# EAGLE design Current ACS712 (EAGLE 6.2)
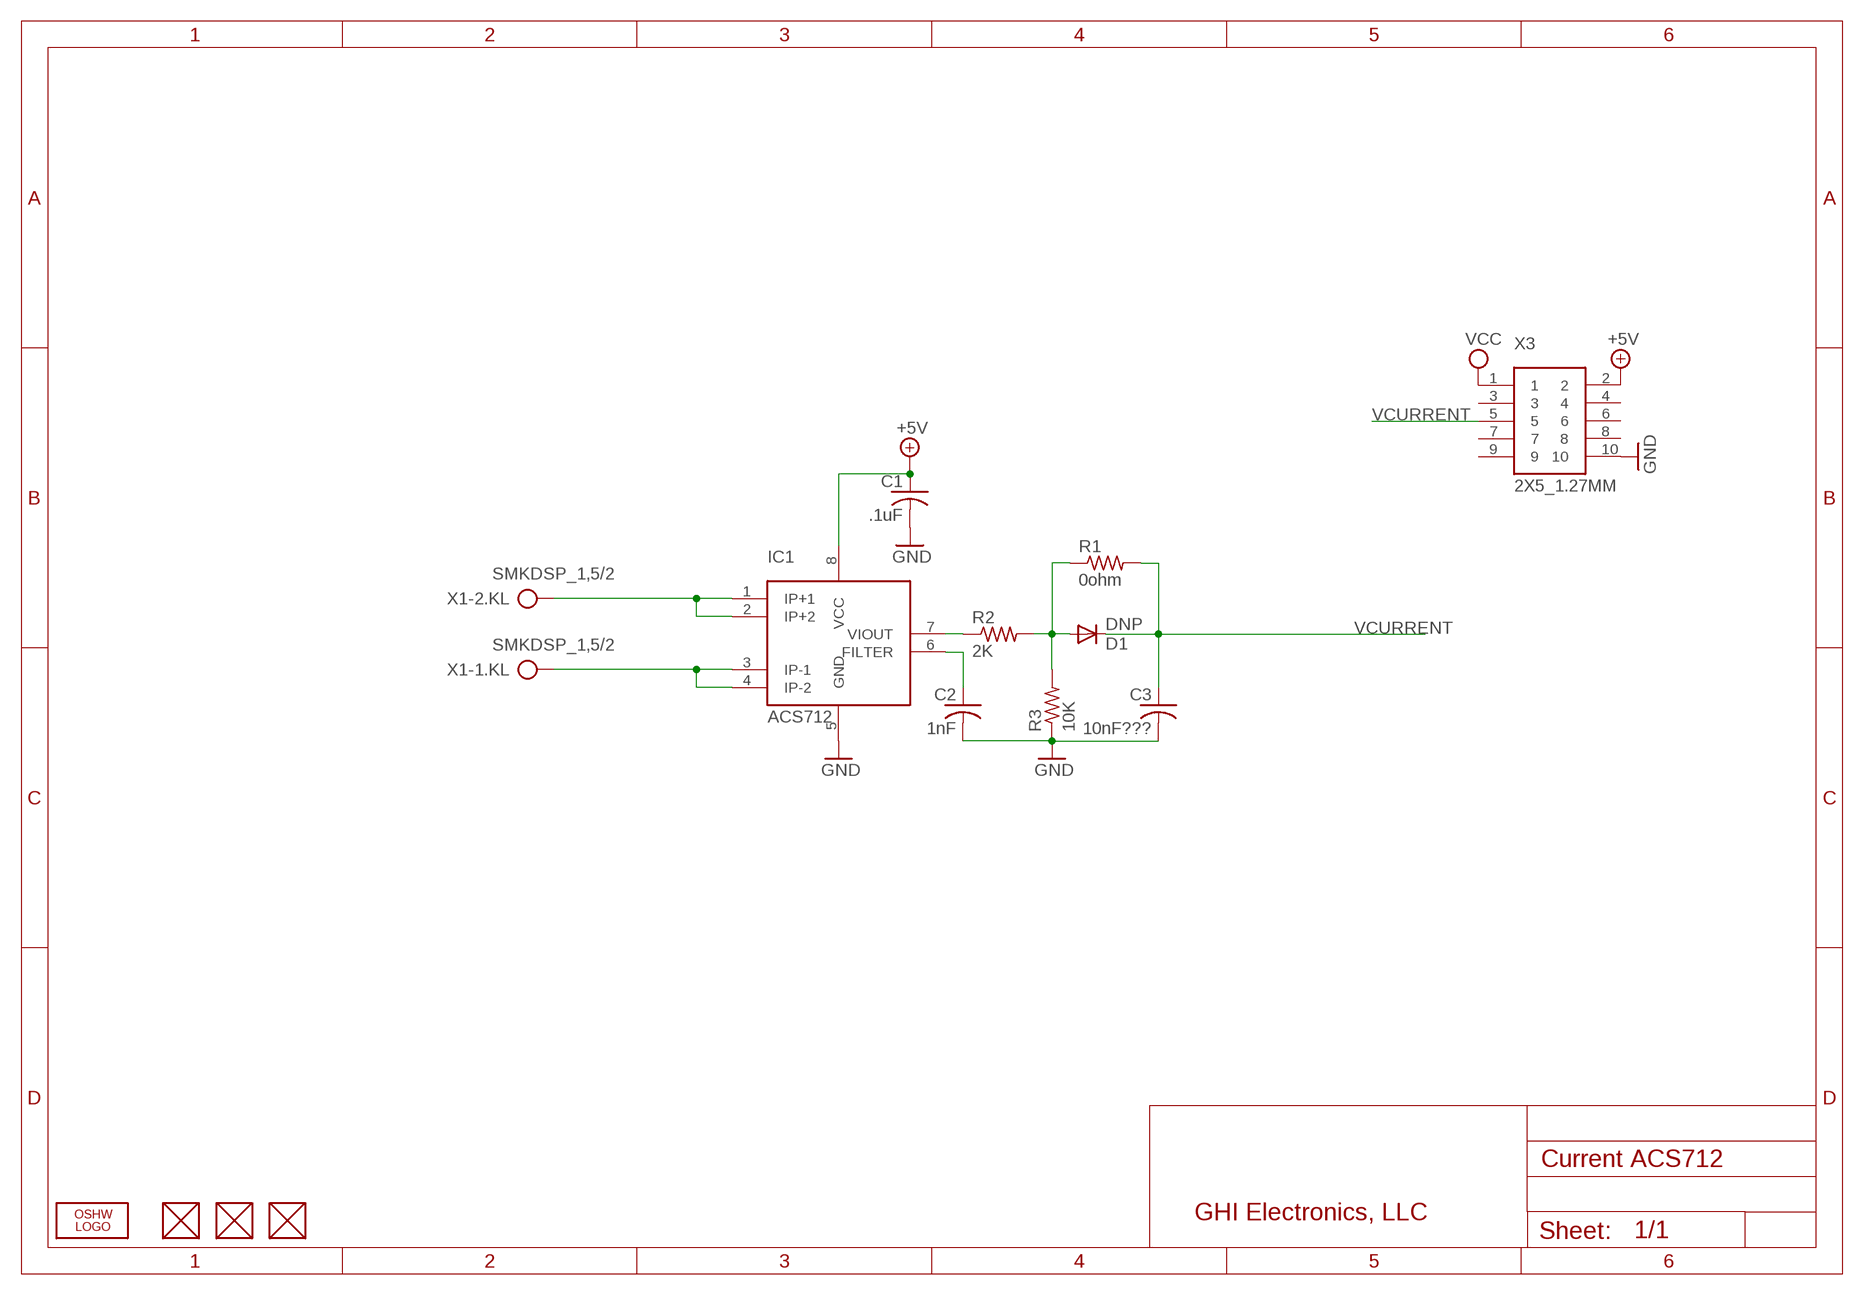
[diagram p0: schematic, sheet 1]

## Parts
C1  .1uF  C-USC0603K  [C0603K]
C2  1nF  C-USC0603K  [C0603K]
C3  10nF???  C-USC0603K  [C0603K]
D1  DNP  DIODE-SOD323-W  [SOD323-W]
FUD1  FIDUCIAL  [FIDUCIAL_40MIL]
FUD2  FIDUCIAL  [FIDUCIAL_40MIL]
FUD3  FIDUCIAL  [FIDUCIAL_40MIL]
IC1  ACS712  [SO8]
LOGO2  LOGO-OSHW-FILLX0200-NT  [OSHW_FILLX200_NOTEXT]
R1  0ohm  R-US_R0603  [R0603]
R2  2K  R-US_R0603  [R0603]
R3  10K  R-US_R0603  [R0603]
X1  SMKDSP_1,5/2  [SMKDSP_1,5/2]
X3  2X5_1.27MM  [2X5_1.27MM]

## Nets
+5V [power]: C1.1 IC1.8(VCC) X3.2
GND: C1.2 C2.2 C3.2 IC1.5(GND) R3.1 X3.10
N$1: IC1.1(IP+1) IC1.2(IP+2) X1.2
N$2: IC1.3(IP-1) IC1.4(IP-2) X1.1
N$3: IC1.7(VIOUT) R2.1
N$4: D1.A R1.1 R2.2 R3.2
N$5: C2.1 IC1.6(FILTER)
VCC: X3.1
VCURRENT: C3.1 D1.C R1.2 X3.5
Unconnected: FUD1.P$1 FUD2.P$1 FUD3.P$1 X3.3 X3.4 X3.6 X3.7 X3.8 X3.9

## Notes on the sheet
- GHI Electronics, LLC

## Library data of the parts
C1-C3 = rcl:C-US: CAPACITOR, American symbol
D1 = diode:DIODE-: DIODE
FUD1-FUD3 = GHI:FIDUCIAL
IC1 = GHI:ACS712
LOGO2 = Logo:LOGO-OSHW-FILL
R1-R3 = rcl:R-US_: RESISTOR, American symbol
X1 = GHI2:SMKDSP_1,5/2: For Blue Wire Connector Block
X3 = GHI:2X5_1.27MM

## Board
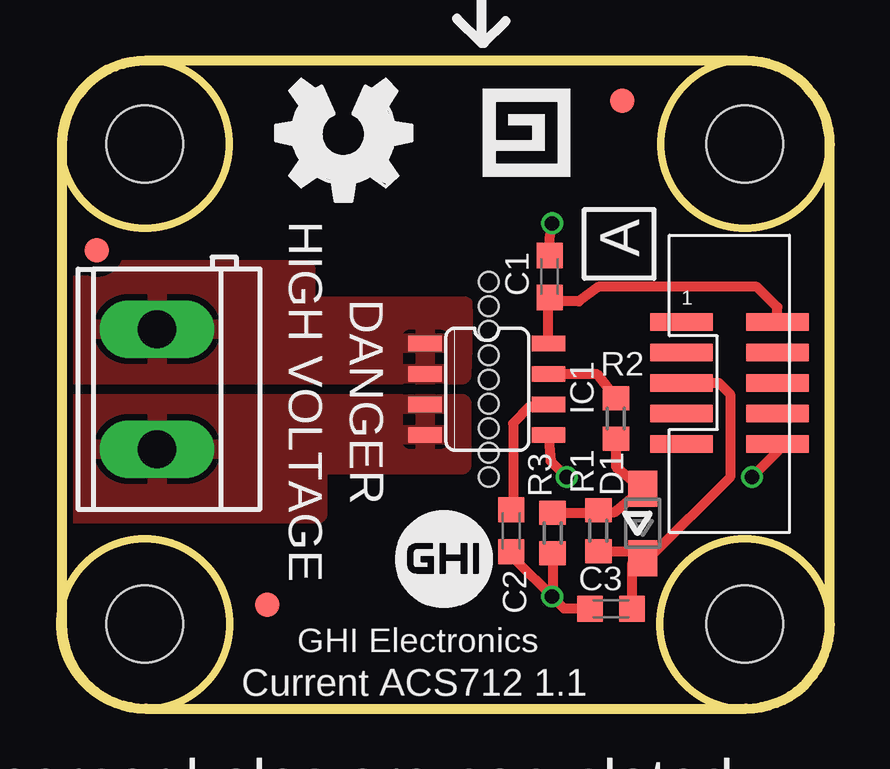
[diagram p1: board, top side]
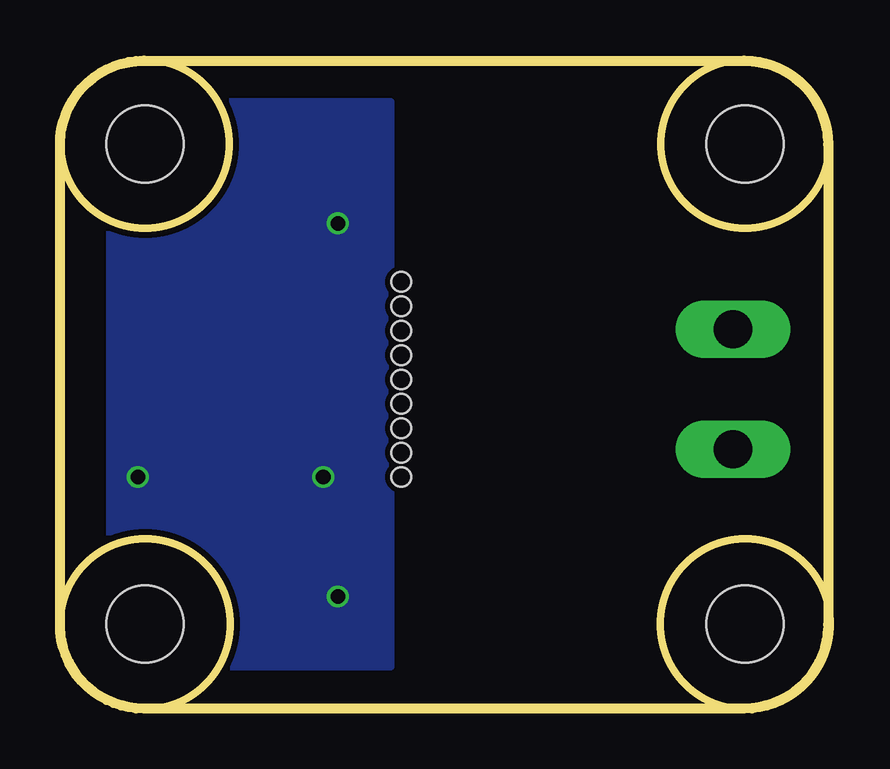
[diagram p2: board, bottom side, seen from below]

Size 32.08 x 27.04 mm. Coordinates in mm from the lower left corner, seen from the top.
Outline: 28.58,0.01 arc90 32.08,3.51 32.08,23.51 arc90 28.58,27.01 3.58,27.01 arc90 0.08,23.51 0.08,3.51 arc90 3.58,0.01 28.58,0.01
Outline: circle at 3.54,23.54 radius 3.5
Outline: circle at 28.54,23.54 radius 3.5
Outline: circle at 28.54,3.54 radius 3.54
Outline: circle at 3.54,3.54 radius 3.54
Copper layers (1+16): Top 0.035mm / dielectric 1.5mm / Bottom 0.035mm
Design rules: minimum track width 6mil, minimum drill 12mil, track to track 6mil, track to pad 6mil, pad to pad 6mil, via to via 6mil, smd to smd 0mil, copper to edge 10mil, drill to drill 10mil, minimum pad ring 10mil, minimum via ring 6mil, stop-mask expansion 2mil, vias tented up to drill 100mil, thermal gap 10mil
Holes 3.2 mm at 3.54,3.54 28.54,23.54 3.54,23.54 28.54,3.54
Holes 0.81 mm at 17.86,10.68 17.86,11.69 17.86,12.71 17.86,13.72 17.86,14.74 17.86,15.76 17.86,16.77 17.86,17.79 17.86,9.66

### Footprints (pad centres in the part's own frame; a part is rotated, then mirrored left to right if it is on the bottom)
C0603K = smd 1.05 x 1.08: 1 -0.875,0; 2 0.875,0
SOD323-W = smd 1.5 x 1.2: A 1.45,0; C -1.45,0
FIDUCIAL_40MIL = smd 1.016 x 1.016: P$1 0,0
SO8 = smd 0.635 x 1.397: 1 -1.905,-2.565; 2 -0.635,-2.565; 3 0.635,-2.565; 4 1.905,-2.565; 5 1.905,2.565; 6 0.635,2.565; 7 -0.635,2.565; 8 -1.905,2.565
R0603 = smd 1 x 1.1: 1 -0.85,0; 2 0.85,0
SMKDSP_1,5/2 = drill 1.6 pad 1.8 long: 1 -2.5,0; 2 2.5,0
2X5_1.27MM = smd 2.6 x 0.74: 1 -2,2.58; 2 2,2.58; 3 -2,1.31; 4 2,1.31; 5 -2,0.04; 6 2,0.04; 7 -2,-1.23; 8 2,-1.23; 9 -2,-2.5; 10 2,-2.5

### Placement (x,y rotation side)
C1  20.4,18.01 90 top
C2  18.8,7.43 270 top
C3  22.96,4.17 180 top
D1  24.28,7.73 90 top
FUD1  8.64,4.33 0 top
FUD2  1.53,19.11 0 top
FUD3  23.43,25.34 0 top
IC1  17.78,13.32 270 top
LOGO2  14.65,26.23 180 top
R1  22.43,7.43 270 top
R2  23.16,12.1 270 top
R3  20.52,7.32 90 top
X1  4.04,13.32 90 top
X3  27.89,13.54 0 top

### Tracks (layer width: path | path; a pad name or v marks a point on that pad's centre or on a via)
+5V
  Top 0.406: X3.2 29.89,16.73 29.04,17.59 22.43,17.59 21.62,16.98 20.77,16.98 C1.1 20.34,16.99 IC1.8
GND  (via drill 0.61)
  Top 0.406: C1.2 20.4,19.62 v20.5,20.23 | IC1.5 20.45,10.32 v21.11,9.66 | R3.1 20.52,5.11 v20.5,4.68 | C3.2 21.01,4.17 v20.5,4.68 | C2.2 19,6.18 v20.5,4.68 | X3.10 29.89,10.72 v28.83,9.66
  pour Bottom: 18.27,25.31 30.05,25.31 30.05,1.74 18.27,1.74
N$1
  pour Top: 16.74,13.93 16.84,16.77 16.84,16.77 10.24,16.77 10.24,18.3 0.59,18.3 0.49,13.93
N$2
  pour Top: 16.74,12.71 16.74,10.17 10.75,10.17 10.75,8.14 -0.63,8.14 -0.63,12.71
N$3
  Top 0.406: IC1.7 22.36,13.95 R2.1
N$4
  Top 0.406: R3.2 22.43,8.17 | R2.2 23.16,10.09 D1.A 23.07,8.17 22.43,8.17 | 22.43,8.17 R1.1
N$5
  Top 0.406: IC1.6 19.56,12.58 18.88,11.9 18.88,8.53 C2.1
VCURRENT
  Top 0.406: C3.1 23.84,6.04 D1.C | X3.5 27.45,13.58 27.92,13.11 27.92,9.66 24.57,6.31 24.11,6.31 D1.C | R1.2 24.08,6.58 D1.C

### Text on the board
tPlace: There is an unplated slot here | HIGH VOLTAGE | A | DANGER | GHI Electronics | Current ACS712 1.1 | corner holes are non-plated | Black PCB with white print | Do not add any manufacturing Code!
bPlace: No text on back side